# Altium schematic sheet driver.SchDoc
size A
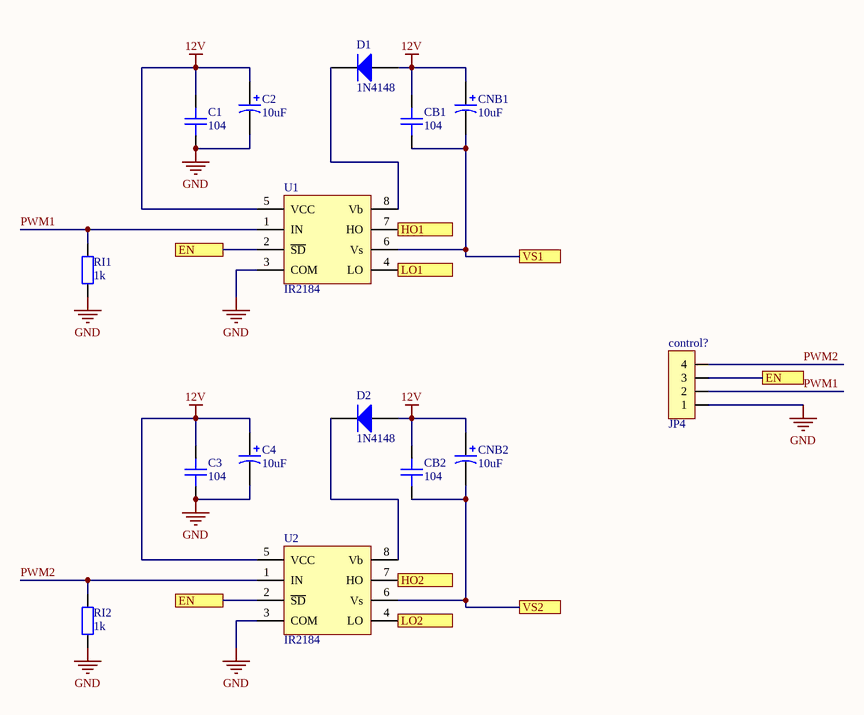
[diagram p0: driver.SchDoc]

## Parts
C1  104  [CAPC-0603 (1608)]
C2  10uF  [CAP_ALUM_SMT_NICHICON_H8xH10]
C3  104  [CAPC-0603 (1608)]
C4  10uF  [CAP_ALUM_SMT_NICHICON_H8xH10]
CB1  104  [CAPC-0603 (1608)]
CB2  104  [CAPC-0603 (1608)]
CNB1  10uF  [CAP_ALUM_SMT_NICHICON_H8xH10]
CNB2  10uF  [CAP_ALUM_SMT_NICHICON_H8xH10]
control?  JP4  [JP4-C1T]
D1  1N4148  [SOD-123]
D2  1N4148  [SOD-123]
RI1  1k  [RESC-0603 (1608)]
RI2  1k  [RESC-0603 (1608)]
U1  IR2184  [DIP8/W0.3]
U2  IR2184  [DIP8/W0.3]

## Ports
EN, HO1, HO2, LO1, LO2, VS1, VS2

## Nets
12V: C1.2 C2.1 C3.2 C4.1 CB1.2 CB2.2 CNB1.1 CNB2.1 D1.1(A) D2.1(A) U1.5(VCC) U2.5(VCC)
GND: C1.1 C2.2 C3.1 C4.2 control?.1 RI1.1 RI2.1 U1.3(COM) U2.3(COM)
EN: control?.3 U1.2(~{SD}) U2.2(~{SD}) ; port EN
HO1: U1.7(HO) ; port HO1
HO2: U2.7(HO) ; port HO2
LO1: U1.4(LO) ; port LO1
LO2: U2.4(LO) ; port LO2
PWM1: control?.2 RI1.2 U1.1(IN)
PWM2: control?.4 RI2.2 U2.1(IN)
VS1: CB1.1 CNB1.2 U1.6(Vs) ; port VS1
VS2: CB2.1 CNB2.2 U2.6(Vs) ; port VS2
NetD1_2: D1.2(K) U1.8(Vb)
NetD2_2: D2.2(K) U2.8(Vb)

## Library data of the parts
C1 C3 CB1 CB2 = 0603N331J500CT: CAP CER 330PF 50V C0G/NP0 0603; MFR: Walsin Technology Corporation; Solder: SMT; Value: 330p/50V; MPN: 0603N331J500CT; Category: CAPACITOR; PinCount: 2
C2 C4 CNB1 CNB2 = UWT1H101MNL1GS: CAP ALUM 100UF 20% 50V SMD; Value: 100uF/50V; Solder: SMT; MPN: UWT1H101MNL1GS; Category: CAPACITOR; PinCount: 2
control? = JP4: WR-PHD 2.54 mm Angled Socket Header; Manufacturer: W¨¹rth Elektronik eiSos GmbH; partNo: 613004143121; ComponentLink1 Description: Manufacturer; ComponentLink2 Description: Datasheet; NoPins: 04; Created Date: 29 March 2013; ComponentLink1URL: http://www.we-online.com; ComponentLink2URL: http://katalog.we-online.de/em/datasheet/6130xx143121.pdf; Created by: Karrer Zheng
D1 D2 = 1N4148-W-7: DIODE GEN PURP 100V 300MA SOD123; MPN: 1N4148W-7-F; MFR: Diodes Incorporated; Solder: SMT; Value: 100V/300MA
RI1 RI2 = RESC NF 0603: RES SMD, Not Fill, 0603; Value: NF; Solder: Not Fill; Category: RESISTOR
U1 U2 = IR2184: Half-Bridge Driver